# Altium project LT3762_Board.PrjPcb
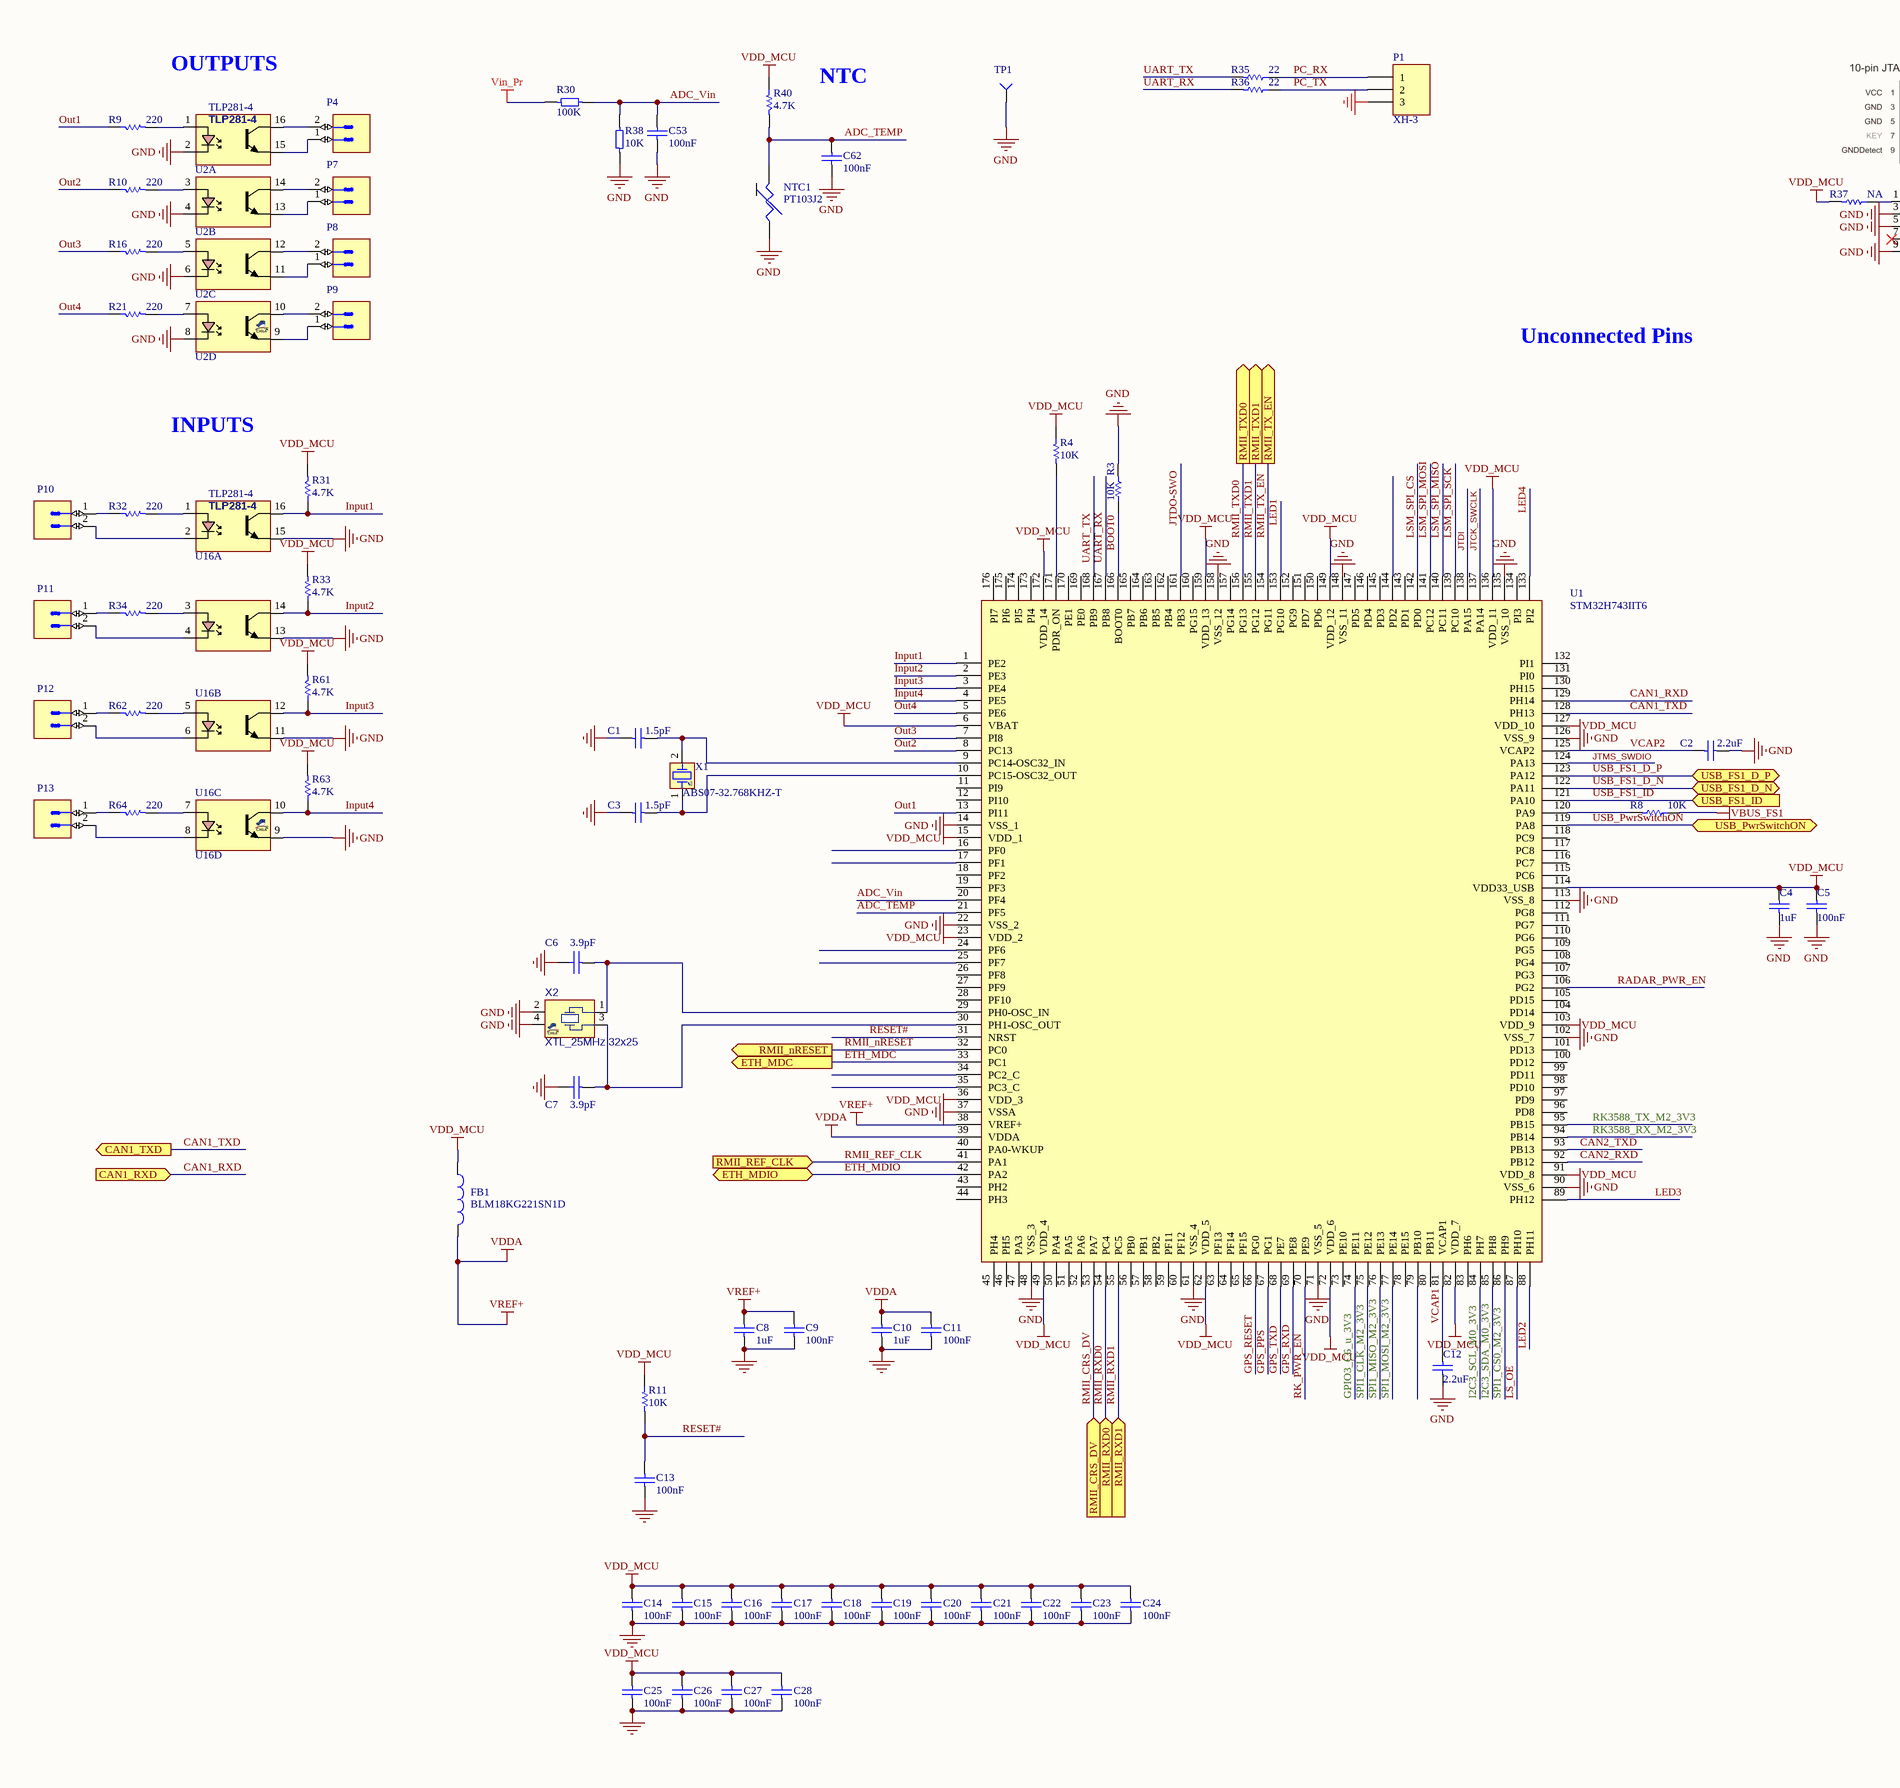
[diagram p0: STM32H743IIT6.SchDoc, left]
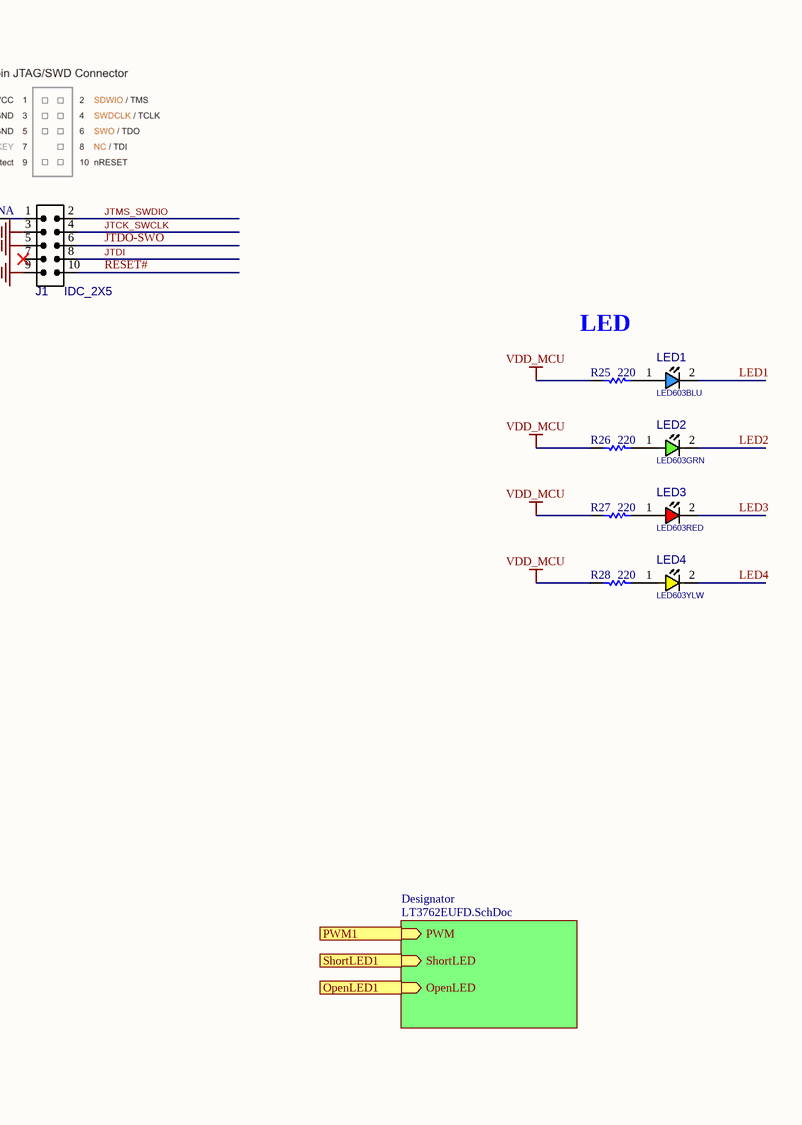
[diagram p1: STM32H743IIT6.SchDoc, right]
3 sheets, 152 parts. Net scope: hierarchical (ports join the sheet entries above them; power ports are global).
Board file: LT3762_Board.PcbDoc
Sheets:
  STM32H743IIT6.SchDoc
    Designator = LT3762EUFD.SchDoc
  Power_CAN_IO_GPS.SchDoc

## Sheet STM32H743IIT6.SchDoc
size A2

### Parts
C1  1.5pF  [C0603]
C2  2.2uF  [C0603]
C3  1.5pF  [C0603]
C4  1uF  [C0603]
C5  100nF  [C0603]
C6  3.9pF  [C0603]
C7  3.9pF  [C0603]
C8  1uF  [C0603]
C9  100nF  [C0603]
C10  1uF  [C0603]
C11  100nF  [C0603]
C12  2.2uF  [C0603]
C13  100nF  [C0603]
C14  100nF  [C0603]
C15  100nF  [C0603]
C16  100nF  [C0603]
C17  100nF  [C0603]
C18  100nF  [C0603]
C19  100nF  [C0603]
C20  100nF  [C0603]
C21  100nF  [C0603]
C22  100nF  [C0603]
C23  100nF  [C0603]
C24  100nF  [C0603]
C25  100nF  [C0603]
C26  100nF  [C0603]
C27  100nF  [C0603]
C28  100nF  [C0603]
C53  100nF  [C0603]
C62  100nF  [C0603]
FB1  BLM18KG221SN1D  [L0603E]
J1  IDC_2X5  [IDC_2X5]
LED1  LED603BLU  [LED0603BLU]
LED2  LED603GRN  [LED0603GRN]
LED3  LED603RED  [LED0603RED]
LED4  LED603YLW  [LED0603YLW]
NTC1  PT103J2  [HDR1X2]
P1  XH-3  [xh-3]
P4  JST PH 2mm 2P RIGHT  [JST B2B-PH-K]  (value not drawn)
P7  JST PH 2mm 2P RIGHT  [JST B2B-PH-K]  (value not drawn)
P8  JST PH 2mm 2P RIGHT  [JST B2B-PH-K]  (value not drawn)
P9  JST PH 2mm 2P RIGHT  [JST B2B-PH-K]  (value not drawn)
P10  JST PH 2mm 2P RIGHT  [JST B2B-PH-K]  (value not drawn)
P11  JST PH 2mm 2P RIGHT  [JST B2B-PH-K]  (value not drawn)
P12  JST PH 2mm 2P RIGHT  [JST B2B-PH-K]  (value not drawn)
P13  JST PH 2mm 2P RIGHT  [JST B2B-PH-K]  (value not drawn)
R3  10K  [R0603]
R4  10K  [R0603]
R8  10K  [R0603]
R9  220  [R0603]
R10  220  [R0603]
R11  10K  [R0603]
R16  220  [R0603]
R21  220  [R0603]
R25  220  [R0603]
R26  220  [R0603]
R27  220  [R0603]
R28  220  [R0603]
R30  100K  [R0603]
R31  4.7K  [R0603]
R32  220  [R0603]
R33  4.7K  [R0603]
R34  220  [R0603]
R35  22  [R0603]
R36  22  [R0603]
R37  NA  [R0603]  (no BOM)
R38  10K  [R0603]
R40  4.7K  [R0603]
R61  4.7K  [R0603]
R62  220  [R0603]
R63  4.7K  [R0603]
R64  220  [R0603]
TP1  TEST POINT  [TEST_POINT]  (value not drawn)  (no BOM)
U1  STM32H743IIT6  [QFP50P2600X2600X160-176N]
U2  TLP281-4  [SO_16]  (parts A,B,C,D of 4)
U16  TLP281-4  [SO_16]  (parts A,B,C,D of 4)
X1  ABS07-32.768KHZ-T  [XTL_2_3215]
X2  XTL_25MHz 32x25  [XTL_4_3225]

### Sub-sheets
Designator = LT3762EUFD.SchDoc: PWM (in), ShortLED (in), OpenLED (in)

### Ports
CAN1_RXD (in), CAN1_TXD (out), ETH_MDC (out), ETH_MDIO (bidir), OpenLED1 (in), PWM1 (in), RMII_CRS_DV (in), RMII_nRESET (out), RMII_REF_CLK (in), RMII_RXD0 (in), RMII_RXD1 (in), RMII_TX_EN (out), RMII_TXD0 (out), RMII_TXD1 (out), ShortLED1 (in), USB_FS1_D_N (bidir), USB_FS1_D_P (bidir), USB_FS1_ID (in), USB_PwrSwitchON (bidir)

### Nets
GND: C1.2 C2.2 C3.2 C4.1 C5.1 C6.2 C7.2 C8.1 C9.1 C10.1 C11.1 C12.1 C13.1 C14.2 C15.2 C16.2 C17.2 C18.2 C19.2 C20.2 C21.2 C22.2 C23.2 C24.2 C25.2 C26.2 C27.2 C28.2 C53.1 C62.1 J1.3 J1.5 J1.9 NTC1.1 P1.3 R3.2 R38.1 TP1.1(TP) U1.14(VSS_1) U1.22(VSS_2) U1.37(VSSA) U1.48(VSS_3) U1.61(VSS_4) U1.71(VSS_5) U1.90(VSS_6) U1.102(VSS_7) U1.113(VSS_8) U1.126(VSS_9) U1.135(VSS_10) U1.148(VSS_11) U1.158(VSS_12) U2.2 U2.4 U2.6 U2.8 U16.9 U16.11 U16.13 U16.15 X2.2 X2.4
VBUS_FS1: R8.1
VDD_MCU: C4.2 C5.2 C14.1 C15.1 C16.1 C17.1 C18.1 C19.1 C20.1 C21.1 C22.1 C23.1 C24.1 C25.1 C26.1 C27.1 C28.1 FB1.1 R4.1 R11.1 R25.1 R26.1 R27.1 R28.1 R31.2 R33.2 R37.2 R40.1 R61.2 R63.2 U1.6(VBAT) U1.15(VDD_1) U1.23(VDD_2) U1.36(VDD_3) U1.49(VDD_4) U1.62(VDD_5) U1.72(VDD_6) U1.82(VDD_7) U1.91(VDD_8) U1.103(VDD_9) U1.114(VDD33_USB) U1.127(VDD_10) U1.136(VDD_11) U1.149(VDD_12) U1.159(VDD_13) U1.172(VDD_14)
VDDA: C8.2 C9.2 C10.2 C11.2 FB1.2 U1.38(VREF+) U1.39(VDDA)  [also labelled VREF+]
Vin_Pr: R30.1
ADC_TEMP: C62.2 NTC1.2 R40.2 U1.21(PF5)
ADC_Vin: C53.2 R30.2 R38.2 U1.20(PF4)
BOOT0: R3.1 U1.166(BOOT0)
CAN1_RXD: U1.129(PH14) ; port CAN1_RXD
CAN1_TXD: U1.128(PH13) ; port CAN1_TXD
CAN2_RXD: U1.92(PB12)
CAN2_TXD: U1.93(PB13)
ETH_MDC: U1.33(PC1) ; port ETH_MDC
ETH_MDIO: U1.42(PA2) ; port ETH_MDIO
GPIO3_C6_u_3V3: U1.74(PE11)
GPS_PPS: U1.67(PG1)
GPS_RESET: U1.66(PG0)
GPS_RXD: U1.69(PE8)
GPS_TXD: U1.68(PE7)
I2C3_SCL_M0_3V3: U1.84(PH7)
I2C3_SDA_M0_3V3: U1.85(PH8)
Input1: R31.1 U1.1(PE2) U16.16
Input2: R33.1 U1.2(PE3) U16.14
Input3: R61.1 U1.3(PE4) U16.12
Input4: R63.1 U1.4(PE5) U16.10
JTCK_SWCLK: J1.4 U1.137(PA14)
JTDI: J1.8 U1.138(PA15)
JTDO-SWO: J1.6 U1.161(PB3)
JTMS_SWDIO: J1.2 U1.124(PA13)
LED1: LED1.2(CATHODE) U1.153(PG10)
LED2: LED2.2(CATHODE) U1.88(PH11)
LED3: LED3.2(CATHODE) U1.89(PH12)
LED4: LED4.2(CATHODE) U1.133(PI2)
LS_OE: U1.87(PH10)
LSM_SPI_CS: U1.142(PD0)
LSM_SPI_MISO: U1.140(PC11)
LSM_SPI_MOSI: U1.141(PC12)
LSM_SPI_SCK: U1.139(PC10)
OpenLED: port OpenLED1, sheet Designator/OpenLED
Out1: R9.1 U1.13(PI11)
Out2: R10.1 U1.8(PC13)
Out3: R16.1 U1.7(PI8)
Out4: R21.1 U1.5(PE6)
PC_RX: P1.1 R35.1
PC_TX: P1.2 R36.1
PWM: port PWM1, sheet Designator/PWM
RADAR_PWR_EN: U1.106(PG2)
RESET#: C13.2 J1.10 R11.2 U1.31(NRST)
RK3588_RX_M2_3V3: U1.94(PB14)
RK3588_TX_M2_3V3: U1.95(PB15)
RK_PWR_EN: U1.70(PE9)
RMII_CRS_DV: U1.53(PA7) ; port RMII_CRS_DV
RMII_nRESET: U1.32(PC0) ; port RMII_nRESET
RMII_REF_CLK: U1.41(PA1) ; port RMII_REF_CLK
RMII_RXD0: U1.54(PC4) ; port RMII_RXD0
RMII_RXD1: U1.55(PC5) ; port RMII_RXD1
RMII_TX_EN: U1.154(PG11) ; port RMII_TX_EN
RMII_TXD0: U1.156(PG13) ; port RMII_TXD0
RMII_TXD1: U1.155(PG12) ; port RMII_TXD1
ShortLED: port ShortLED1, sheet Designator/ShortLED
SPI1_CLK_M2_3V3: U1.75(PE12)
SPI1_CS0_M2_3V3: U1.86(PH9)
SPI1_MISO_M2_3V3: U1.76(PE13)
SPI1_MOSI_M2_3V3: U1.77(PE14)
UART_RX: R36.2 U1.167(PB8)
UART_TX: R35.2 U1.168(PB9)
USB_FS1_D_N: U1.122(PA11) ; port USB_FS1_D_N
USB_FS1_D_P: U1.123(PA12) ; port USB_FS1_D_P
USB_FS1_ID: U1.121(PA10) ; port USB_FS1_ID
USB_PwrSwitchON: U1.119(PA8) ; port USB_PwrSwitchON
VCAP1: C12.2 U1.81(VCAP1)
VCAP2: C2.1 U1.125(VCAP2)
NetC1_1: C1.1 U1.9(PC14-OSC32_IN) X1.2(OSC2)
NetC3_1: C3.1 U1.10(PC15-OSC32_OUT) X1.1(OSC1)
NetC6_1: C6.1 U1.29(PH0-OSC_IN) X2.1
NetC7_1: C7.1 U1.30(PH1-OSC_OUT) X2.3
NetJ1_1: J1.1 R37.1
NetLED1_1: LED1.1(ANODE) R25.2
NetLED2_1: LED2.1(ANODE) R26.2
NetLED3_1: LED3.1(ANODE) R27.2
NetLED4_1: LED4.1(ANODE) R28.2
NetP4_1: P4.1 U2.15
NetP4_2: P4.2 U2.16
NetP7_1: P7.1 U2.13
NetP7_2: P7.2 U2.14
NetP8_1: P8.1 U2.11
NetP8_2: P8.2 U2.12
NetP9_1: P9.1 U2.9
NetP9_2: P9.2 U2.10
NetP10_1: P10.1 R32.1
NetP10_2: P10.2 U16.2
NetP11_1: P11.1 R34.1
NetP11_2: P11.2 U16.4
NetP12_1: P12.1 R62.1
NetP12_2: P12.2 U16.6
NetP13_1: P13.1 R64.1
NetP13_2: P13.2 U16.8
NetR4_2: R4.2 U1.171(PDR_ON)
NetR8_2: R8.2 U1.120(PA9)
NetR9_2: R9.2 U2.1
NetR10_2: R10.2 U2.3
NetR16_2: R16.2 U2.5
NetR21_2: R21.2 U2.7
NetR32_2: R32.2 U16.1
NetR34_2: R34.2 U16.3
NetR62_2: R62.2 U16.5
NetR64_2: R64.2 U16.7

Not connected (* = marked no-connect by the designer): J1 7*; U1 11(PI9) 12(PI10) 16(PF0) 17(PF1) 18(PF2) 19(PF3) 24(PF6) 25(PF7) 26(PF8) 27(PF9) 28(PF10) 34(PC2_C) 35(PC3_C) 40(PA0-WKUP) 43(PH2) 44(PH3) 45(PH4) 46(PH5) 47(PA3) 50(PA4) 51(PA5) 52(PA6) 56(PB0) 57(PB1) 58(PB2) 59(PF11) 60(PF12) 63(PF13) 64(PF14) 65(PF15) 73(PE10) 78(PE15) 79(PB10) 80(PB11) 83(PH6) 96(PD8) 97(PD9) 98(PD10) 99(PD11) 100(PD12) 101(PD13) 104(PD14) 105(PD15) 107(PG3) 108(PG4) 109(PG5) 110(PG6) 111(PG7) 112(PG8) 115(PC6) 116(PC7) 117(PC8) 118(PC9) 130(PH15) 131(PI0) 132(PI1) 134(PI3) 143(PD1) 144(PD2) 145(PD3) 146(PD4) 147(PD5) 150(PD6) 151(PD7) 152(PG9) 157(PG14) 160(PG15) 162(PB4) 163(PB5) 164(PB6) 165(PB7) 169(PE0) 170(PE1) 173(PI4) 174(PI5) 175(PI6) 176(PI7)

### Notes on the sheet
- OUTPUTS
- NTC
- Unconnected Pins
- LED
- INPUTS

### Library data of the parts
C1 C3 = Capacitor_ST: Value: 100nF; Revision: July-2002: Re-released for DXP Platform.
C2 C4 C5 C8-C12 = Cap: Value: 10nF; Published: 8-Jun-2000; Revision: July-2002: Re-released for DXP Platform.; Publisher: Altium Limited
C6 C7 C14-C28 = CAP
  C14-C28: Published: 8-Jun-2000; Revision: July-2002: Re-released for DXP Platform.; Publisher: Altium Limited; Value: 100nF
C13 C53 C62 = CAP: Value: 100pF; Published: 8-Jun-2000; Revision: July-2002: Re-released for DXP Platform.; Publisher: Altium Limited
FB1 = Inductor: Ferrite Bead; Value: 100uH; Published: 8-Jun-2000; Revision: July-2002: Re-released for DXP Platform.; Publisher: Altium Limited
J1 = IDC_2X5: CONN, IDC, Male, pitch: 2.54mm, 10POS; VALUE: IDC_2X5
LED1 = LED_SMD_0603_BLU: LED, SMD, 0603, BLUE; PARAM: 30mA, 470nm, 120° Angle; DESC: DESCRIPTION; MANF_P#: MANF_PART#; PARAM2: 2.2~3V; MANF: MANF; ASSEMBLY: ASSEMBLY; PRICE: PRICE; VALUE: LED603BLU
LED2 = LED_SMD_0603_GRN: LED, SMD, 0603, GREEN; PARAM: 20mA; MANF: Kingbright; DESC: DESCRIPTION; MANF_P#: APT1608SGC; PARAM2: 2.2V; ASSEMBLY: ASSEMBLY; PRICE: 1: 0.14$, 100: 6.8$; VALUE: LED603GRN
LED3 = LED_SMD_0603_RED: LED, SMD, 0603, RED; PARAM: 30mA, 640nm; DESC: DESCRIPTION; MANF_P#: MANF_PART#; PARAM2: 1.8~2.5V; MANF: MANF; ASSEMBLY: ASSEMBLY; PRICE: PRICE; VALUE: LED603RED
LED4 = LED_SMD_0603_YLW: LED, SMD, 0603, YELLOW; DESC: DESCRIPTION; MANF_P#: MANF_PART#; PARAM2: 2.2V; MANF: MANF; ASSEMBLY: ASSEMBLY; PRICE: PRICE; VALUE: LED603YLW
NTC1 = NTC power: THERMISTOR 10K OHM +/-0.20 C; Device Code: 143161
P1 = Header 3: Header, 3-Pin; LatestRevisionDate: 17-Jul-2002; LatestRevisionNote: Re-released for DXP Platform.; Publisher: Altium Limited
P4 P7-P13 = PHOENIX_1803426: JST PH 2P RIGHT; Part Description: 8A 160 V, Pitch: 3.81mm, 2 Positions Header; Manufacturer: PHOENIX CONTACT; Manufacturer Part Number: 1803426 (MCV 1,5/2-G-3,81); PressFit: No; Part Number: PHOENIX_1803426; Component Kind: Standard; Component Type: Standard; Footprint: PHOENIX_1803426; Pin Count: 2; Mounted: Yes; Socket: No; SMD: No; Sense: No; Status: None; ComponentHeight: 9.2mm; HelpURL: \\cern.ch\dfs\Applications\Altium\Datasheets\PHOENIX_1803426.pdf; Author: CERN DEM JLC; CreateDate: 5/4/2010; LatestRevisionDate: 5/4/2010
R3 R35 R36 = res1: Value: 1K; Published: 8-Jun-2000; Revision: July-2002: Re-released for DXP Platform.; Publisher: Altium Limited
R4 R8-R11 R16 R21 R25-R28 R31-R34 R37 R40 R61-R64 = Res1: Value: 1K; Published: 8-Jun-2000; Revision: July-2002: Re-released for DXP Platform.; Publisher: Altium Limited
R30 R38 = Resistor SMD
  R30: Value: 100K
  R38: Value: 10K
TP1 = TEST POINT: Board Qty: 100; PCB Name: Main_PCB
U1 = STM32H743IIT6: Integrated Circuit; Manufacturer_Name: STMicroelectronics; Datasheet Link: https://componentsearchengine.com/Datasheets/1/STM32H743IIT6.pdf; Height: 1.6mm; Manufacturer_Part_Number: STM32H743IIT6; Mouser Part Number: 511-STM32H743IIT6; Mouser Price/Stock: https://www.mouser.co.uk/ProductDetail/STMicroelectronics/STM32H743IIT6?qs=FNcb6ahWXRzE163cq8Rfjg%3D%3D; Arrow Part Number: STM32H743IIT6; Arrow Price/Stock: https://www.arrow.com/en/products/stm32h743iit6/stmicroelectronics?region=nac
U2 U16 = OPTC_TR16P_TLP281-4_SMD: OPTOCOUPLER, TRANSISTOR, QUAD; MANF_P#: TLP281-4A; PRICE: 4000t@PAYA; VALUE: TLP281-4; PACKAGE: DIP-16SMD
X1 = XTL_2_32.768_3215A: Crystal, 32.768KHz, 3pF, 20PPM; MANF: ABRACON; MANF_P#: ABS07W-32.768kHz-D-2-T; PARAM: -40~85oC; VALUE: XTL_32.768KHz; PARAM2: 3pF, 20PPM; PRICE: 1$
X2 = XTL_4_25MHz_3225: CRYSTAL 25.00 MHZ 18pF, 10PPM; MANF: EPSON; DESC: DESCRIPTION; DIST#: MOUSER; PARAM2: PARAM; MANF_P#: TSX-3225 25.0000MF10P-C3; ASSEMBLY: ASSEMBLY; PARAM: 10PPM; PRICE: 0.5$; VALUE: XTL_25MHz 32x25

## Sheet LT3762EUFD.SchDoc: 60V SYNCHRONOUS BOOST LED CONTROLLER
size 375 x 292 mm; Date: <DATE>; DATE1: <DATE>; PCB DESIGNER: KIM T.; ECO: 1; Drawn: KIM T.; Page Number: 1; Cage Code: WITH PROGRAMMABLE CURRENT LIMIT; FAB: 1ST PROTOTYPE; APP. ENG.: TIGER Z.; Page Count: 1; SIZE: N/A; RevCode: 4; DWG NAME: LT3762EUFD; Doc: DC2342A; DsnPath: D:\Projects\LT3762_Board\DC2342A\DC2342A-4.DSN; SchematicName: DC2342A-4; PageName: LT3762EUFD; PageSize: Custom; TopSchematic: True; SPICEModelCacheTEYFTZDY: <root> / <DocumentId>TEYFTZDY</DocumentId> / <CacheFrame Number="0"> / <Model Name="4828_74408942470_47u" Kind="CKT"> / <Text>******* / .subckt 4828_74408942470_47u 1 2 / Rp 1 2 12539 / Cp 1 2 6.04294p / Rs 1 N3 0.515 / L1 N3 2 47u / .ends 4828_74408942470_47u</Text> / </Model> / <Model Name="1890_74435561100_10u" Kind="CKT"> / <Text>******* / .subckt 1890_74435561100_10u 1 2 / Rp 1 2 1459 / Cp 1 2 9.409p / Rs 1 N3 0.0069 / L1 N3 2 10u / .ends 1890_74435561100_10u</Text> / </Model> / </CacheFrame> / </root>
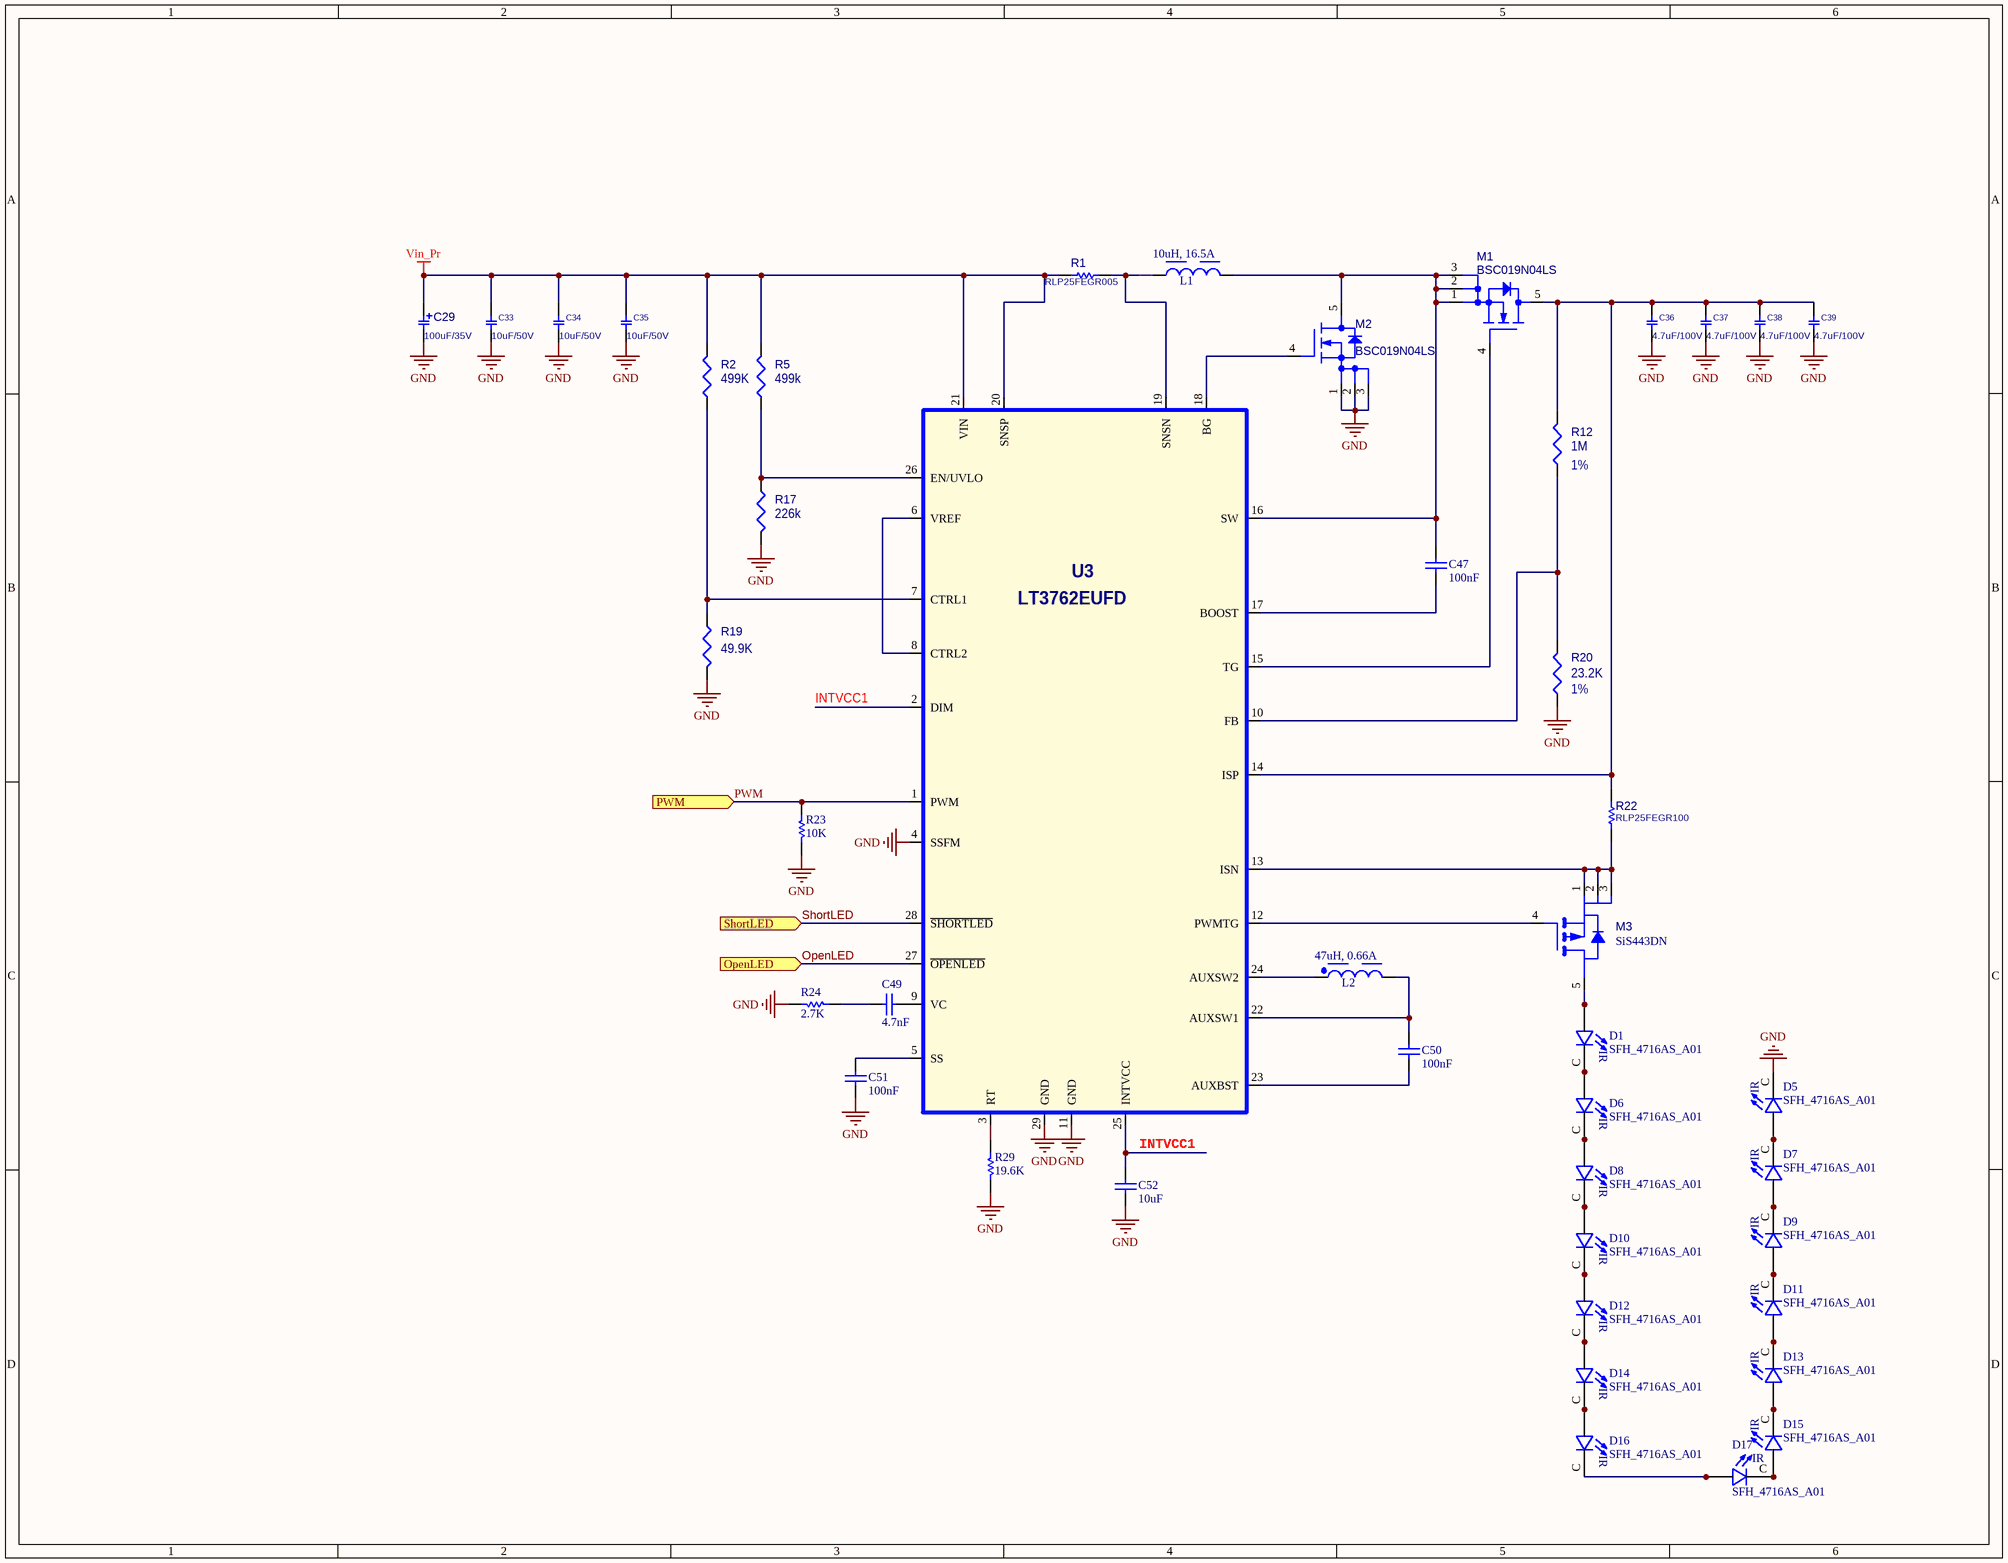
[diagram p2: LT3762EUFD.SchDoc]

### Parts
C29  100uF/35V  [C_EL_D8L10]
C33  10uF/50V  [C1210]
C34  10uF/50V  [C1210]
C35  10uF/50V  [C1210]
C36  4.7uF/100V  [C1210]
C37  4.7uF/100V  [C1210]
C38  4.7uF/100V  [C1210]
C39  4.7uF/100V  [C1210]
C47  100nF  [C0603]
C49  4.7nF  [C0603]
C50  100nF  [C0603]
C51  100nF  [C0603]
C52  10uF  [C0603]
D1  SFH_4716AS_A01  [LED_SFH_4716AS_A01]
D5  SFH_4716AS_A01  [LED_SFH_4716AS_A01]
D6  SFH_4716AS_A01  [LED_SFH_4716AS_A01]
D7  SFH_4716AS_A01  [LED_SFH_4716AS_A01]
D8  SFH_4716AS_A01  [LED_SFH_4716AS_A01]
D9  SFH_4716AS_A01  [LED_SFH_4716AS_A01]
D10  SFH_4716AS_A01  [LED_SFH_4716AS_A01]
D11  SFH_4716AS_A01  [LED_SFH_4716AS_A01]
D12  SFH_4716AS_A01  [LED_SFH_4716AS_A01]
D13  SFH_4716AS_A01  [LED_SFH_4716AS_A01]
D14  SFH_4716AS_A01  [LED_SFH_4716AS_A01]
D15  SFH_4716AS_A01  [LED_SFH_4716AS_A01]
D16  SFH_4716AS_A01  [LED_SFH_4716AS_A01]
D17  SFH_4716AS_A01  [LED_SFH_4716AS_A01]
L1  10uH, 16.5A  [WE-HCI_1890]
L2  47uH, 0.66A  [WE-SPC_4828]
M1  BSC019N04LS  [PG-TDSON-8]
M2  BSC019N04LS  [PG-TDSON-8]
M3  SiS443DN  [POWERPAK-1212-8-S-5P]
R1  RLP25FEGR005  [R2512]
R2  499K  [R0603]
R5  499k  [R0603]
R12  1M  6th Part Field: 1%  [R0603]
R17  226k  [R0603]
R19  49.9K  [R0603]
R20  23.2K  6th Part Field: 1%  [R0603]
R22  RLP25FEGR100  [R2512]
R23  10K  [R0603]
R24  2.7K  [R0603]
R29  19.6K  [R0603]
U3  LT3762EUFD  [QFN-28-4X5]

### Ports
OpenLED (in), PWM (in), ShortLED (in)

### Nets
GND: C29.2 C33.1 C34.1 C35.1 C36.1 C37.1 C38.1 C39.1 C51.2 C52.2 D5.C M2.1(SOURCE) M2.2(SOURCE) M2.3(SOURCE) R17.1 R19.2 R20.1 R23.2 R24.2 R29.2 U3.4(SSFM) U3.11(GND) U3.29(GND)
Vin_Pr: C29.1 C33.2 C34.2 C35.2 R1.1 R2.2 R5.2 U3.20(SNSP) U3.21(VIN)
INTVCC1: C52.1 U3.2(DIM) U3.25(INTVCC)
OpenLED: U3.27(~{OPENLED}) ; port OpenLED
PWM: R23.1 U3.1(PWM) ; port PWM
ShortLED: U3.28(~{SHORTLED}) ; port ShortLED
NetC36_2: C36.2 C37.2 C38.2 C39.2 M1.5(DRAIN) R12.2 R22.2 U3.14(ISP)
NetC47_1: C47.1 L1.2 M1.1(SOURCE) M1.2(SOURCE) M1.3(SOURCE) M2.5(DRAIN) U3.16(SW)
NetC47_2: C47.2 U3.17(BOOST)
NetC49_1: C49.1 U3.9(VC)
NetC49_2: C49.2 R24.1
NetC50_1: C50.1 L2.2 U3.22(AUXSW1)
NetC50_2: C50.2 U3.23(AUXBST)
NetC51_1: C51.1 U3.5(SS)
NetD1_A1: D1.A1(A) D1.A2(A) M3.5
NetD1_C: D1.C D6.A1(A) D6.A2(A)
NetD5_A1: D5.A1(A) D5.A2(A) D7.C
NetD6_C: D6.C D8.A1(A) D8.A2(A)
NetD7_A1: D7.A1(A) D7.A2(A) D9.C
NetD8_C: D8.C D10.A1(A) D10.A2(A)
NetD9_A1: D9.A1(A) D9.A2(A) D11.C
NetD10_C: D10.C D12.A1(A) D12.A2(A)
NetD11_A1: D11.A1(A) D11.A2(A) D13.C
NetD12_C: D12.C D14.A1(A) D14.A2(A)
NetD13_A1: D13.A1(A) D13.A2(A) D15.C
NetD14_C: D14.C D16.A1(A) D16.A2(A)
NetD15_A1: D15.A1(A) D15.A2(A) D17.C
NetD16_C: D16.C D17.A1(A) D17.A2(A)
NetL1_1: L1.1 R1.2 U3.19(SNSN)
NetL2_1: L2.1 U3.24(AUXSW2)
NetM1_4: M1.4(GATE) U3.15(TG)
NetM2_4: M2.4(GATE) U3.18(BG)
NetM3_1: M3.1 M3.2 M3.3 R22.1 U3.13(ISN)
NetM3_4: M3.4 U3.12(PWMTG)
NetR2_1: R2.1 R19.1 U3.7(CTRL1)
NetR5_1: R5.1 R17.2 U3.26(EN/UVLO)
NetR12_1: R12.1 R20.2 U3.10(FB)
NetR29_1: R29.1 U3.3(RT)
NetU3_6: U3.6(VREF) U3.8(CTRL2)

### Notes on the sheet
- (in symbol SFH_4716AS_A01) IR

### Library data of the parts
C29 = CAP_SMD_EL_220uF_35v: CAP, SMD, ELEC,; MANF_P#: MANF_PART#; DESC: DESCRIPTION; DIST#: MOUSER; PARAM: 20%; PARAM2: 35v; VALUE: 220uF; PRICE: 10= -$; MANF: MANF; ASSEMBLY: ASSEMBLY
C33-C39 = CAP_SMD_MLCC_1210: CAP, MLCC; PARAM: -, -%; MANF_P#: MANF_PART#; PARAM2: -V; VALUE: -F; PN: GRM32ER71H106KA12L; PRICE: 100= 1$; MANF: -; ASSEMBLY: ASSEMBLY
C47 C50 C51 = CAP: Published: 8-Jun-2000; Revision: July-2002: Re-released for DXP Platform.; Publisher: Altium Limited; Value: 100nF
C49 C52 = CAP: Value: 100nF; Published: 8-Jun-2000; Revision: July-2002: Re-released for DXP Platform.; Publisher: Altium Limited
D1 D5-D17 = SFH_4716AS_A01: OSLON Black Series (850 nm) - 150Â°; Package: None; Price: None; Value: *; MP: SFH_4716AS_A01; Availability: Unavailable
L1 = 74435561100: WE-HCI SMT Flat Wire High Current Inductor, size 1890, 10uH, 16.5A, 6.9mOhm; Manufacturer: Wurth Elektronik; Case/Size Code: 1890; Material: WE-PERM 2; Saturation Current: 21.5A; Self Resonant Frequency: 14MHz; PN: Wurth Elektronik 74435561100; Manufacturer Part Number: 74435561100; Category: Power Inductors; Match Code: WE-HCI; ComponentLink1Description: Website Link; ComponentLink1URL: https://www.we-online.com/redexpert/article/74435561100?ad; ComponentLink2Description: Datasheet Link; ComponentLink2URL: https://www.we-online.com/redexpert/spec/74435561100?ad; Mount: Surface Mount; Operating Temperature Max: 150°C; Operating Temperature Min: -40°C; Packaging: Tape and Reel; Length: 18.2mm; Width: 18.2mm; Height: 8.9mm; DC Resistance: 6.9mOhm; Inductance: 10uH; Performance Rated Current: 16.5A
L2 = 74408942470: WE-SPC SMT Power Inductor, size 4828, 47uH, 0.66A, 0.608Ohm; Manufacturer: Wurth Elektronik; Case/Size Code: 4828; DC Resistance: 0.515Ohm; Saturation Current: 1A; Self Resonant Frequency: 10MHz; PN: Wurth Elektronik 74408942470; Manufacturer Part Number: 74408942470; Category: Power Inductors; Match Code: WE-SPC; ComponentLink1Description: Website Link; ComponentLink1URL: https://www.we-online.com/redexpert/article/74408942470?ad; ComponentLink2Description: Datasheet Link; ComponentLink2URL: https://www.we-online.com/redexpert/spec/74408942470?ad; Mount: Surface Mount; Operating Temperature Max: 125°C; Operating Temperature Min: -40°C; Packaging: Tape and Reel; Length: 4.8mm; Width: 4.8mm; Height: 2.8mm; DC Resistance Max: 0.608Ohm; Inductance: 47uH; Rated Current: 0.66A
M1 = 2N7000_6: Part Reference: M2; Value: BSC019N04LS; PCB Footprint: PG-TDSON-8
M2 = 2N7000_6: Part Reference: M1; Value: BSC019N04LS; PCB Footprint: PG-TDSON-8
M3 = SI4463BDY_1: 7TH PART FIELD: P-MOSFET; 4TH PART FIELD: VISHAY; Part Reference: M5; 5TH PART FIELD: Si4463BDY; Value: SiS443DN; PCB Footprint: POWERPAK-1212-8-S-5P
R1 = RES_SMD_2512: 3W 5mΩ ±50ppm/℃ ±1% 2512 Current Sense Shunt Resistors; PARAM: 1%, 1W; DESC: DESCRIPTION; DIST#: MOUSER; VALUE: 10K; MANF_P#: -; MANF: -; ASSEMBLY: ASSEMBLY; PRICE: -; PARAM2: -
R2 = RES0402: 7th Part Field: Res.,; 3rd Part Field: 0603; Part Reference: R3; Value: 1M; PCB Footprint: 0603
R5 = RES0402: 7th Part Field: Res.,; 3rd Part Field: 0603; Part Reference: R2; Value: 499k; PCB Footprint: 0603
R12 = RES0402: 7th Part Field: Res.,; 3rd Part Field: 0603; Part Reference: R16; Value: 1M; PCB Footprint: 0603
R17 = RES0402: 7th Part Field: Res.,; 3rd Part Field: 0603; Part Reference: R5; Value: 226k; PCB Footprint: 0603
R19 = RES0402: 7th Part Field: Res.,; 3rd Part Field: 0603; Part Reference: R4; Value: 205k; PCB Footprint: 0603
R20 = RES0402: 7th Part Field: Res.,; 3rd Part Field: 0603; Part Reference: R17; Value: 36.5k; PCB Footprint: 0603
R22 = RES_SMD_2512: 3W 100mΩ ±50ppm/℃ ±1% 2512 Current Sense Shunt Resistors; PARAM: 1%, 1W; DESC: DESCRIPTION; DIST#: MOUSER; VALUE: 10K; MANF_P#: -; MANF: -; ASSEMBLY: ASSEMBLY; PRICE: -; PARAM2: -
R23 R24 R29 = Res1: Value: 1K; Published: 8-Jun-2000; Revision: July-2002: Re-released for DXP Platform.; Publisher: Altium Limited
U3 = LT3932EFE_37: Part Reference: U1; Value: LT3762EUFD; PCB Footprint: QFN-28-4X5

## Sheet Power_CAN_IO_GPS.SchDoc
size A2
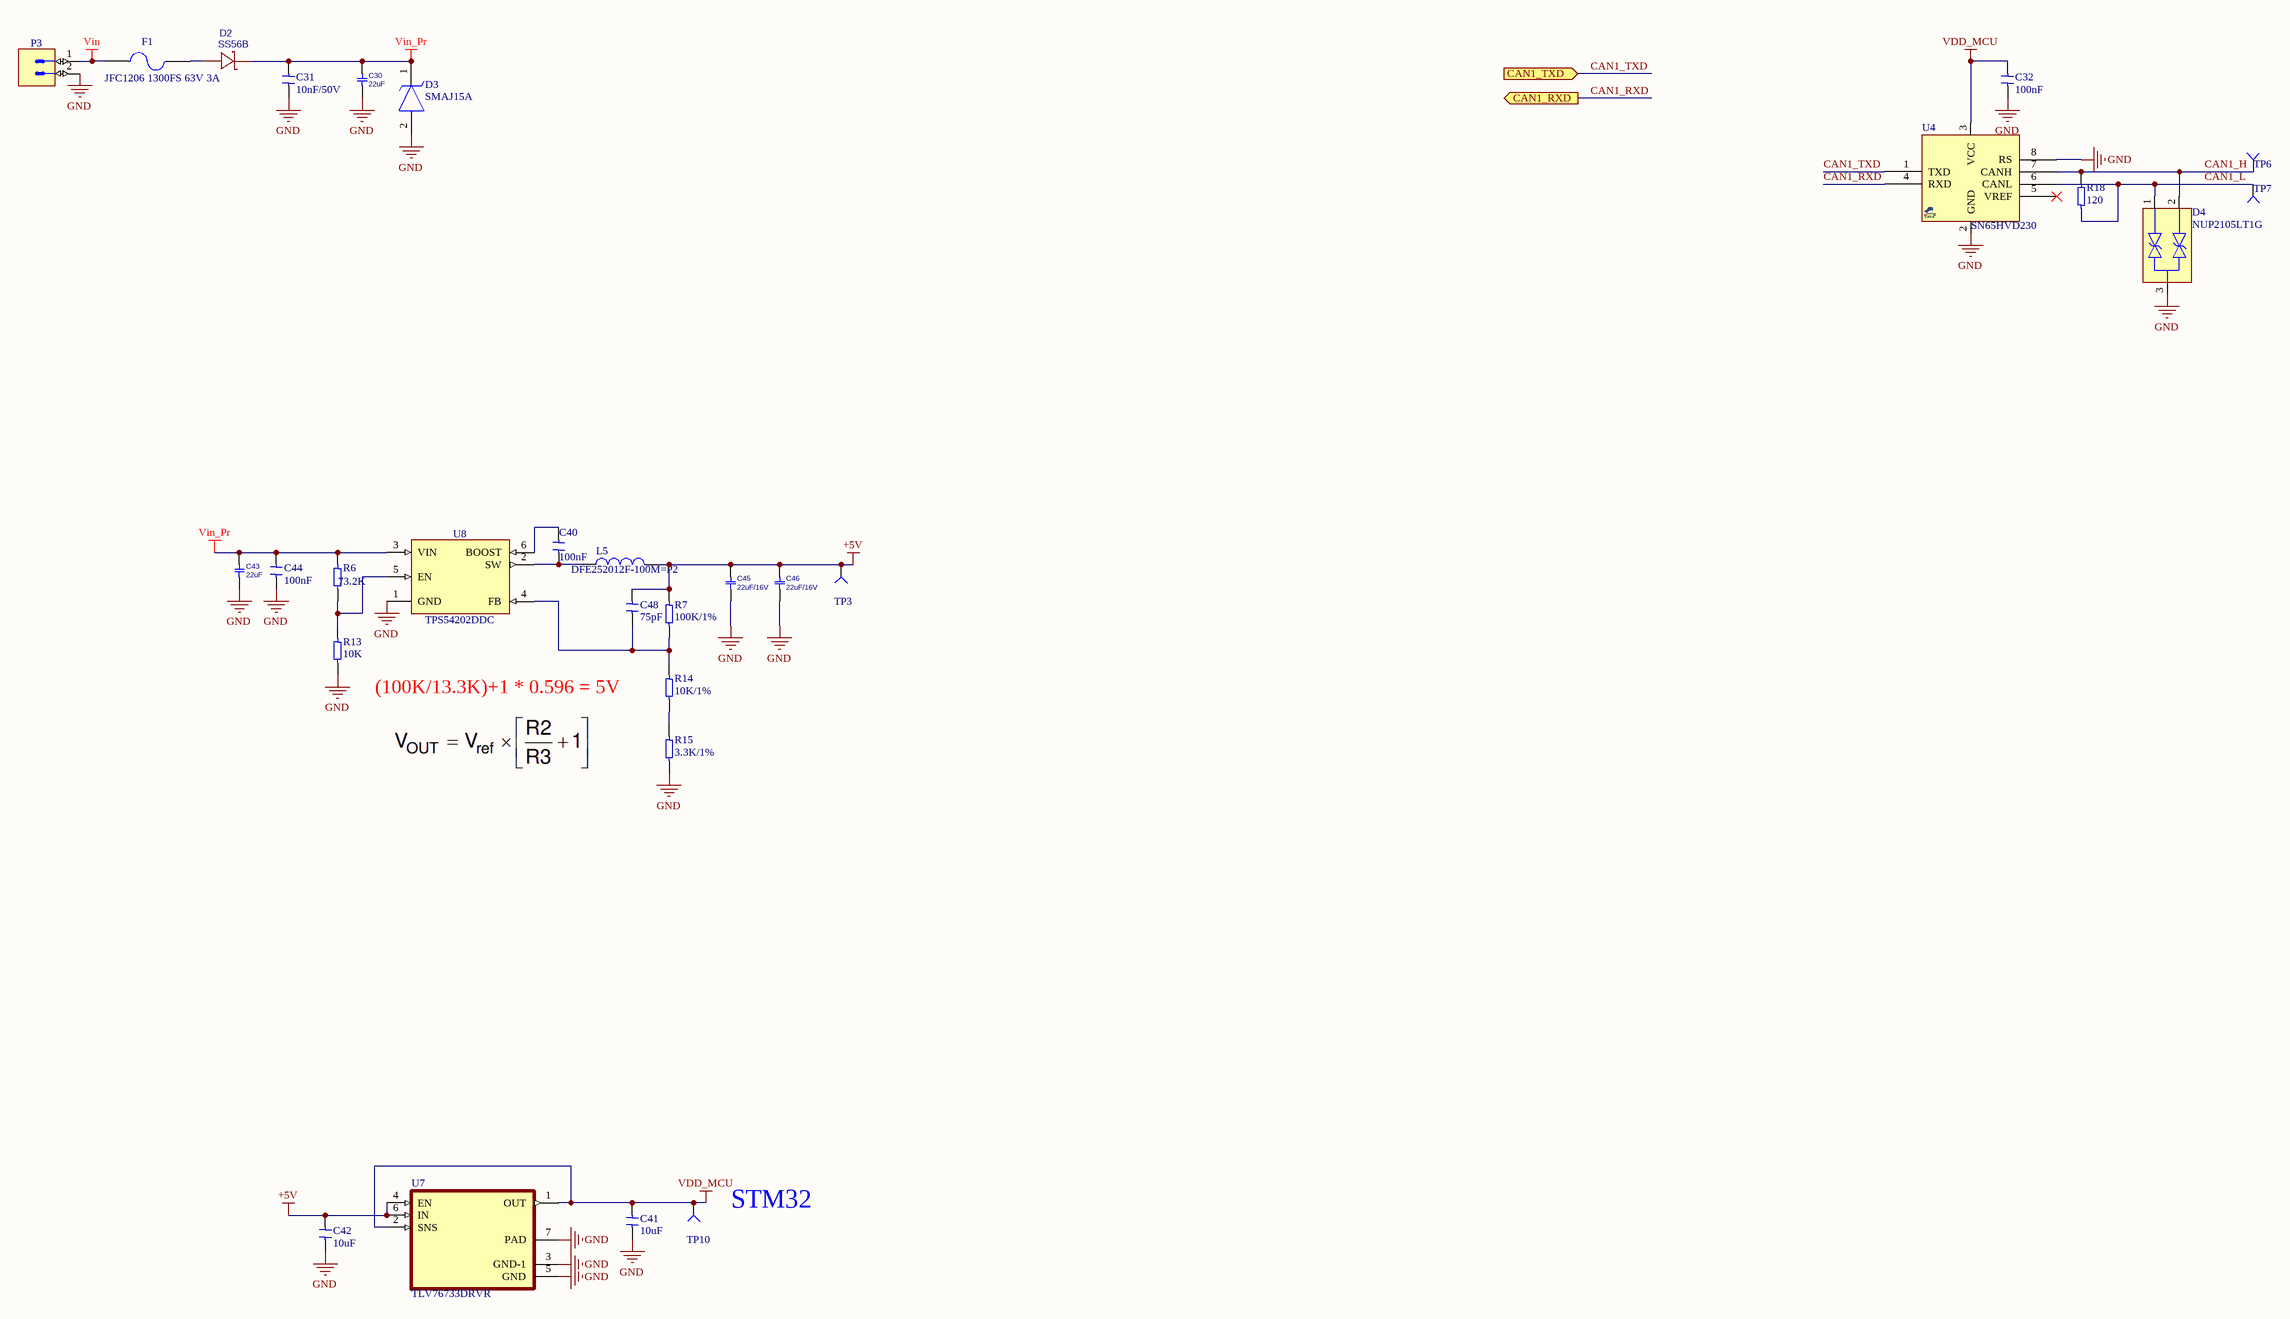
[diagram p3: Power_CAN_IO_GPS.SchDoc]

### Parts
C30  22uF  [C1206E]
C31  10nF/50V  [C0603E]
C32  100nF  [C0603E]
C40  100nF  [C0603E]
C41  10uF  [C0603E]
C42  10uF  [C0603E]
C43  22uF  [C1206E]
C44  100nF  [C0603E]
C45  22uF/16V  [C1206E]
C46  22uF/16V  [C1206E]
C48  75pF  [C0603E]
D2  SS56B  [SMB_L4.6-W3.6-LS5.3-RD]
D3  SMAJ15A  [DIOM5026X229N]
D4  NUP2105LT1G  [SOT95P237X111-3N]
F1  JFC1206 1300FS 63V 3A  [1206 FUSE]
L5  DFE252012F-100M=P2  [INDC2520X120N]
P3  KF2EDGV+K-3.81-2P  [PHOENIX_1803426]  (value not drawn)
R6  73.2K  [R0603E]
R7  100K/1%  [R0603E]
R13  10K  [R0603E]
R14  10K/1%  [R0603E]
R15  3.3K/1%  [R0603E]
R18  120  [R0603E]
TP3  TEST POINT  [TEST_POINT]  (value not drawn)  (no BOM)
TP6  TEST POINT  [TEST_POINT]  (value not drawn)  (no BOM)
TP7  TEST POINT  [TEST_POINT]  (value not drawn)  (no BOM)
TP10  TEST POINT  [TEST_POINT]  (value not drawn)  (no BOM)
U4  SN65HVD230  [SO_8]
U7  TLV76733DRVR  [SON65P200X200X80-7N]
U8  TPS54202DDC  [SOT95P280X100-6N]

### Ports
CAN1_RXD (out), CAN1_TXD (in)

### Nets
+5V: C42.2 C45.2 C46.2 C48.2 L5.2 R7.1 TP3.1(TP) U7.4(EN) U7.6(IN)
GND: C30.1 C31.1 C32.1 C41.1 C42.1 C43.1 C44.1 C45.1 C46.1 D3.2(A) D4.3 P3.2 R13.2 R15.2 U4.2(GND) U4.8(RS) U7.3(GND-1) U7.5(GND) U7.7(PAD) U8.1(GND)
VDD_MCU: C32.2 C41.2 TP10.1(TP) U4.3(VCC) U7.1(OUT) U7.2(SNS)
Vin: F1.1 P3.1
Vin_Pr: C30.2 C31.2 C43.2 C44.2 D2.1(K) D3.1(K) R6.1 U8.3(VIN)
CAN1_H: D4.2 R18.2 TP6.1(TP) U4.7(CANH)
CAN1_L: D4.1 R18.1 TP7.1(TP) U4.6(CANL)
CAN1_RXD: U4.4(RXD) ; port CAN1_RXD
CAN1_TXD: U4.1(TXD) ; port CAN1_TXD
NetC40_1: C40.1 U8.6(BOOST)
NetC40_2: C40.2 L5.1 U8.2(SW)
NetC48_1: C48.1 R7.2 R14.1 U8.4(FB)
NetD2_2: D2.2(A) F1.2
NetR6_2: R6.2 R13.1 U8.5(EN)
NetR14_2: R14.2 R15.1

Not connected (* = marked no-connect by the designer): U4 5(VREF)*

### Notes on the sheet
- (100K/13.3K)+1 * 0.596 = 5V
- (near TP10) STM32

### Library data of the parts
C30 C43 C45 C46 = CAP_SMD_MLCC_22u25V: CAP, MLCC, X5R 22uF 25V 20% 1206; PARAM: X5R, 20%; MANF_P#: TMK316BBJ226ML-T; MANF: Taiyo Yuden; DESC: CAP, MLCC, 22uF, 25V, X5R,  20%, 1206; PARAM2: 25V; PRICE: 0.572$
  C30 C43: VALUE: 22uF
  C45 C46: VALUE: 22uF/16V
C31 C32 C40-C42 C44 C48 = Capacitor SMD
  C31: Value: 10nF/50V
  C32 C40 C44: Value: 100nF
  C41 C42: Value: 10uF
  C48: Value: 75pF
D2 = SS54C: 40V 5A Schottky Rectifier; Manufacturer: LGE(鲁光); Manufacturer Part: SS54; Contributor: LCSC; Supplier: LCSC; Supplier Part: C330398; JLCPCB Part Class: Extended Part; spicePre: D; spiceSymbolName: SS54C
D3 = SMAJ24A: TVS Diode (Uni-directional); Manufacturer_Name: LITTELFUSE; Datasheet Link: https://componentsearchengine.com/Datasheets/2/SMAJ24A.pdf; Height: 2.29mm; Manufacturer_Part_Number: SMAJ24A; Mouser Part Number: 576-SMAJ24A; Mouser Price/Stock: https://www.mouser.co.uk/ProductDetail/Littelfuse/SMAJ24A?qs=HR2RnyOI4E78ZevQKM2hdA%3D%3D; Arrow Part Number: SMAJ24A; Arrow Price/Stock: https://www.arrow.com/en/products/smaj24a/littelfuse?region=nac
D4 = NUP2105LT1G: Dual Bi-Directional TVS Diode 350W 3-Pin SOT-23 | ON Semiconductor NUP2105LT1G; SnapEDA_Link: https://www.snapeda.com/parts/NUP2105LT1G/Onsemi/view-part/?ref=snap; Package: SOT-23-3 ON Semiconductor; Value: *; MF: ON Semiconductor; MP: NUP2105LT1G; Check_prices: https://www.snapeda.com/parts/NUP2105LT1G/Onsemi/view-part/?ref=eda
F1 = Fuse SMD1206: Fuse Type Fast Acting with 63V, 3A, 1206; Designer: Abbas Basereh; Desc.: SMD Fuses 1206; Data: 16-12-2016
L5 = DFE252012F-100M=P2: Inductor with Inductance: 10uH Tol. +/-20%, Package: 1008 (2520); MF: Murata Electronics; SnapEDA_Link: https://www.snapeda.com/parts/DFE252012F-100M=P2/Murata%20Electronics%20North%20America/view-part/1498782/?ref=snap; Value: *; Digi-Key_Part_Number: 490-13050-1-ND; Mouser-Purchase-URL: https://snapeda.com/shop?store=Mouser&id=1498782; MP: DFE252012F-100M=P2; DigiKey-Purchase-URL: https://snapeda.com/shop?store=DigiKey&id=1498782; Package: 2520 Murata; Check_prices: https://www.snapeda.com/parts/DFE252012F-100M=P2/Murata%20Electronics%20North%20America/view-part/1498782/?ref=eda
P3 = PHOENIX_1803426: Connector 2 Male; Part Description: 8A 160 V, Pitch: 3.81mm, 2 Positions Header; Manufacturer: PHOENIX CONTACT; Manufacturer Part Number: 1803426 (MCV 1,5/2-G-3,81); PressFit: No; Part Number: PHOENIX_1803426; Component Kind: Standard; Component Type: Standard; Pin Count: 2; Mounted: Yes; Socket: No; SMD: No; Sense: No; Status: None; ComponentHeight: 9.2mm; HelpURL: \\cern.ch\dfs\Applications\Altium\Datasheets\PHOENIX_1803426.pdf; Author: CERN DEM JLC; CreateDate: 5/4/2010; LatestRevisionDate: 5/4/2010
R6 R7 R13-R15 R18 = Resistor SMD
  R6: Value: 73.2K
  R7: Value: 100K/1%
  R13: Value: 10K
  R14: Value: 10K/1%
  R15: Value: 3.3K/1%
  R18: Value: 120
TP3 TP6 TP7 TP10 = TEST POINT: Board Qty: 100; PCB Name: Main_PCB
U4 = SN65HVD230_SOP8: CAN,  Transceivers, 3.3V (VDD); MANF: Texas Instruments; MANF_P#: SN65HVD230D, SN65HVD230QD; PARAM: -40~85oC; PRICE: 2.3$@MOUSER; PARAM2: 3.3V (VDD); VALUE: SN65HVD230
U7 = TLV76733DRVR: Adjustable- and fixed-output, 1-A, 16-V, positive-voltage low-dropout (LDO) linear regulator; MF: Texas Instruments; SnapEDA_Link: https://www.snapeda.com/parts/TLV76733DRVR/Texas+Instruments/view-part/?ref=snap; Package: WSON-6 Texas Instruments; Value: *; MP: TLV76733DRVR; Check_prices: https://www.snapeda.com/parts/TLV76733DRVR/Texas+Instruments/view-part/?ref=eda
U8 = TPS54202DDC: 4.5V to 28V Input, 2-A Output, EMI Friendly / Synchronous Step Down Converter; Part Description: 4.5V to 28V Input, 2A Output, EMI Friendly Synchronous Step Down Converter; Manufacturer: TEXAS INSTRUMENTS; PressFit: No; Bonding: No; Part Number: TPS54202DDC; Component Kind: Standard; Component Type: Standard; Device: TPS54202DDC; PackageDescription: SOT23, 0.95mm Pitch; 6 Pin, 1.625mm W X 2.90mm L X 1.00mm H body, IPC Medium Density; Manufacturer Part Number: TPS54202DDC; Pin Count: 5; Case: SOT23-6; Mounted: Yes; Socket: No; SMD: Yes; Sense: No; ComponentHeight: 1.1mm; HelpURL: \\cern.ch\dfs\Applications\Altium\Datasheets\TPS54202.pdf; Author: CERN DEM HF; CreateDate: 6/10/2022; LatestRevisionDate: 6/10/2022

## Nets that join several sheets
GND: STM32H743IIT6 (61 pins), LT3762EUFD (23 pins), Power_CAN_IO_GPS (20 pins)
VDD_MCU: STM32H743IIT6 (46 pins), Power_CAN_IO_GPS (6 pins)
Vin_Pr: STM32H743IIT6 (R30.1), LT3762EUFD (9 pins), Power_CAN_IO_GPS (8 pins)